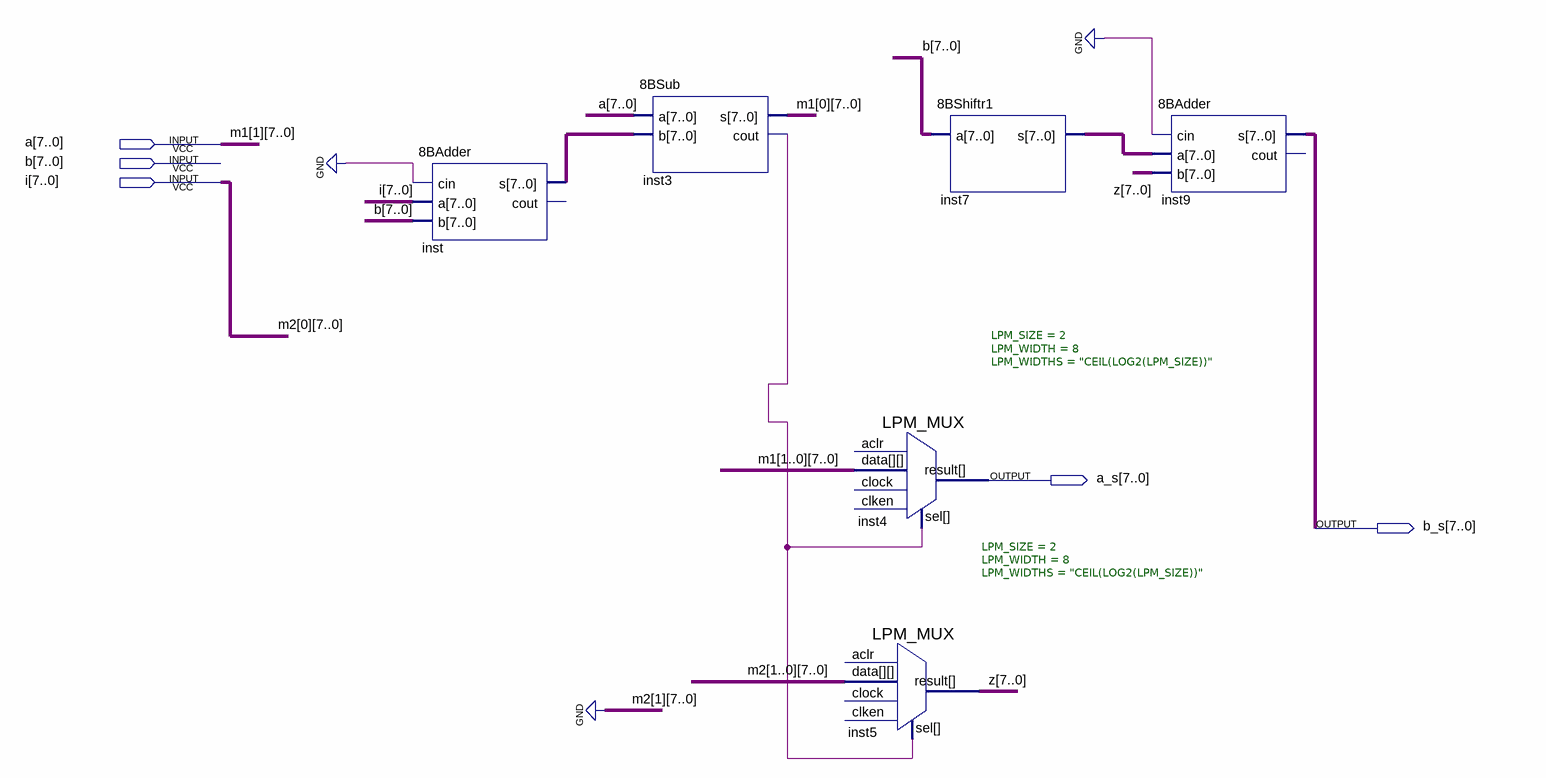
[diagram p0: schematic sheet]
// Quartus schematic 8BSqrt2.bdf as structural Verilog: 6 symbols, 5 pins
module \8BSqrt2  (
  input  [7:0] a,
  input  [7:0] b,
  input  [7:0] i,
  output [7:0] a_s,
  output [7:0] b_s
);

  wire inst3_cout;
  wire [7:0] inst7_s, inst_s, m1_0, m2_0, z;

  \8BAdder  inst (.cin(1'b0), .a(i), .b(b), .s(inst_s));  // open: cout
  \8BSub  inst3 (.a(a), .b(inst_s), .s(m1_0), .cout(inst3_cout));
  LPM_MUX #(.LPM_SIZE(2), .LPM_WIDTH(8), .LPM_WIDTHS("CEIL(LOG2(LPM_SIZE))")) inst4 (
    .data({a, m1_0}), .sel(inst3_cout), .result(a_s));  // open: clock, aclr, clken
  LPM_MUX #(.LPM_SIZE(2), .LPM_WIDTH(8), .LPM_WIDTHS("CEIL(LOG2(LPM_SIZE))")) inst5 (
    .data({{8{1'b0}}, m2_0}), .sel(inst3_cout), .result(z));  // open: clock, aclr, clken
  \8BShiftr1  inst7 (.a(b), .s(inst7_s));
  \8BAdder  inst9 (.cin(1'b0), .a(inst7_s), .b(z), .s(b_s));  // open: cout

  // Other names for the same wires on the sheet: m1_1[7:0] = a
endmodule
